# EAGLE schematic iMX233-OLinuXino-NANO_Rev_B (EAGLE 7.2.0)
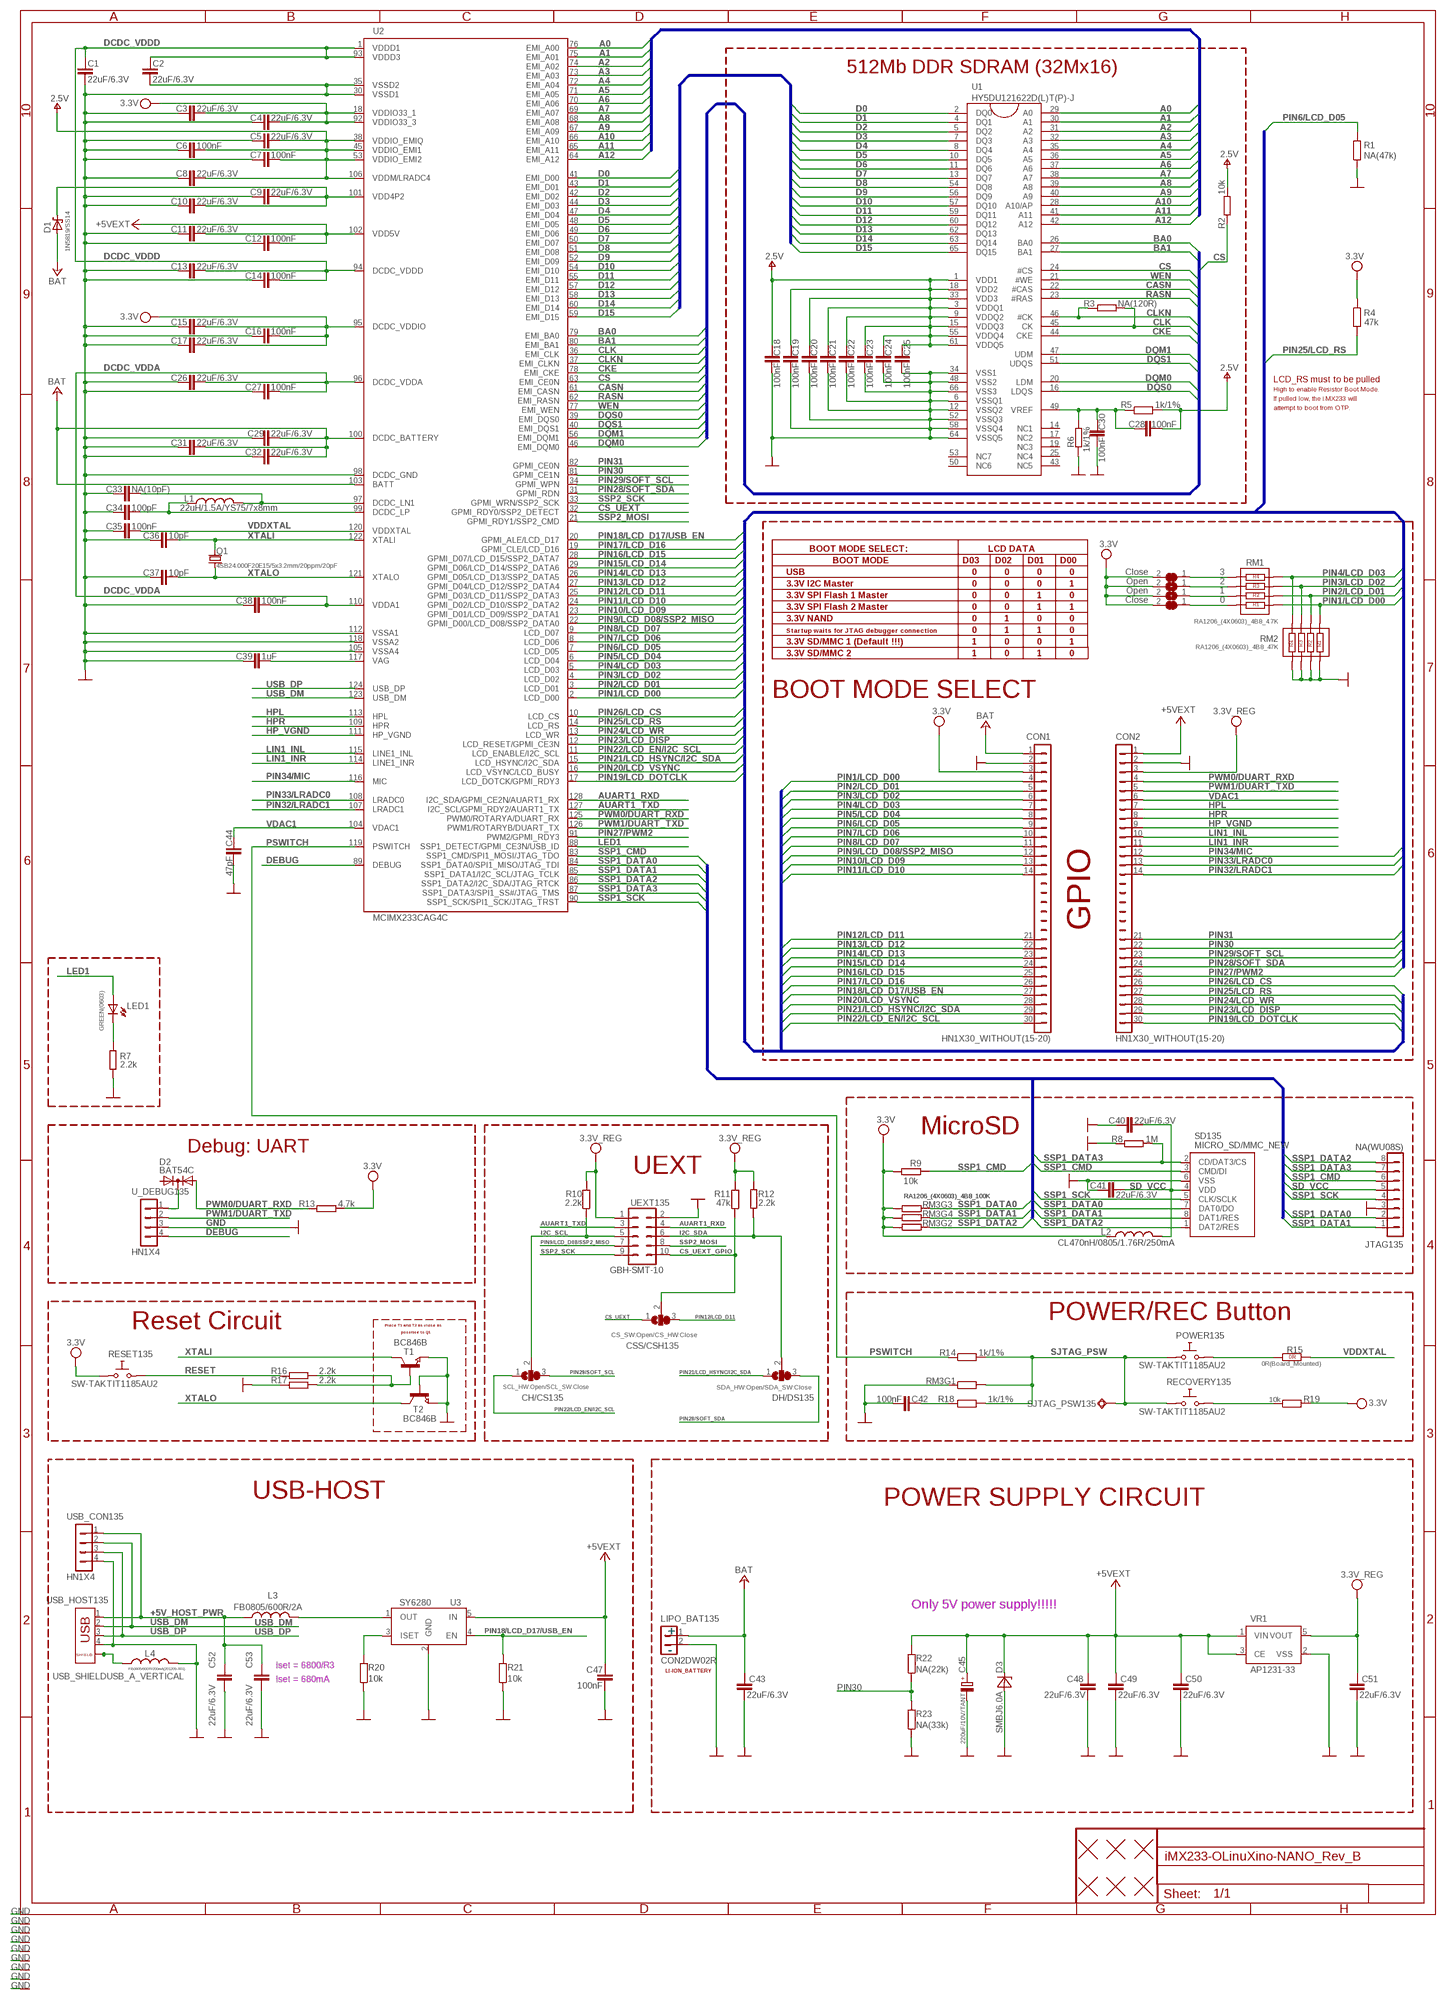
[diagram p0: schematic, sheet 1]

## Parts
0  Close  SJSJ_SMALLER  [SJ_1_SMALLER]
1  Open  SJSJ_SMALLER  [SJ_1_SMALLER]
2  Open  SJSJ_SMALLER  [SJ_1_SMALLER]
3  Close  SJSJ_SMALLER  [SJ_1_SMALLER]
C1  22uF/6.3V  C-EUC0603_DWS  [C0603_DWS]
C2  22uF/6.3V  C-EUC0603_DWS  [C0603_DWS]
C3  22uF/6.3V  C-EUC0603_DWS  [C0603_DWS]
C4  22uF/6.3V  C-EUC0603_DWS  [C0603_DWS]
C5  22uF/6.3V  C-EUC0603_DWS  [C0603_DWS]
C6  100nF  C-EUC0402_TI  [C0402_TI]
C7  100nF  C-EUC0402_TI  [C0402_TI]
C8  22uF/6.3V  C-EUC0603_DWS  [C0603_DWS]
C9  22uF/6.3V  C-EUC0603_DWS  [C0603_DWS]
C10  22uF/6.3V  C-EUC0603_DWS  [C0603_DWS]
C11  22uF/6.3V  C-EUC0603_DWS  [C0603_DWS]
C12  100nF  C-EUC0402_TI  [C0402_TI]
C13  22uF/6.3V  C-EUC0603_DWS  [C0603_DWS]
C14  100nF  C-EUC0402_TI  [C0402_TI]
C15  22uF/6.3V  C-EUC0603_DWS  [C0603_DWS]
C16  100nF  C-EUC0402_TI  [C0402_TI]
C17  22uF/6.3V  C-EUC0603_DWS  [C0603_DWS]
C18  100nF  C-EUC0402_TI  [C0402_TI]
C19  100nF  C-EUC0402_TI  [C0402_TI]
C20  100nF  C-EUC0402_TI  [C0402_TI]
C21  100nF  C-EUC0402_TI  [C0402_TI]
C22  100nF  C-EUC0402_TI  [C0402_TI]
C23  100nF  C-EUC0402_TI  [C0402_TI]
C24  100nF  C-EUC0402_TI  [C0402_TI]
C25  100nF  C-EUC0402_TI  [C0402_TI]
C26  22uF/6.3V  C-EUC0603_DWS  [C0603_DWS]
C27  100nF  C-EUC0402_TI  [C0402_TI]
C28  100nF  C-EUC0402_TI  [C0402_TI]
C29  22uF/6.3V  C-EUC0603_DWS  [C0603_DWS]
C30  100nF  C-EUC0402_TI  [C0402_TI]
C31  22uF/6.3V  C-EUC0603_DWS  [C0603_DWS]
C32  22uF/6.3V  C-EUC0603_DWS  [C0603_DWS]
C33  NA(10pF)  C-EUC0603_DWS  [C0603_DWS]
C34  100pF  C-EUC0603_DWS  [C0603_DWS]
C35  100nF  C-EUC0402_TI  [C0402_TI]
C36  10pF  C-EUC0603_DWS  [C0603_DWS]
C37  10pF  C-EUC0603_DWS  [C0603_DWS]
C38  100nF  C-EUC0402_TI  [C0402_TI]
C39  1uF  C-EUC0603_DWS  [C0603_DWS]
C40  22uF/6.3V  C-EUC0603_DWS  [C0603_DWS]
C41  22uF/6.3V  C-EUC0603_DWS  [C0603_DWS]
C42  100nF  C-EUC0402_TI  [C0402_TI]
C43  22uF/6.3V  C-EUC0603_DWS  [C0603_DWS]
C44  47pF  C-EUC0603_DWS  [C0603_DWS]
C45  220uF/10V/TANT  CPOL-EUCT7343  [CT7343]
C47  100nF  C-EUC0603_DWS  [C0603_DWS]
C48  22uF/6.3V  C-EUC0603_DWS  [C0603_DWS]
C49  22uF/6.3V  C-EUC0603_DWS  [C0603_DWS]
C50  22uF/6.3V  C-EUC0603_DWS  [C0603_DWS]
C51  22uF/6.3V  C-EUC0603_DWS  [C0603_DWS]
C52  22uF/6.3V  C-EUC0603_DWS  [C0603_DWS]
C53  22uF/6.3V  C-EUC0603_DWS  [C0603_DWS]
CH/CS135  SCL_HW:Open/SCL_SW:Close  SJ2W4  [SJ_2_SMALLER]
CON1  HN1X30_WITHOUT(15-20)  CON30_WITHOUT(15-20)  [HN1X30_WITHOUT(15-20)]
CON2  HN1X30_WITHOUT(15-20)  CON30_WITHOUT(15-20)  [HN1X30_WITHOUT(15-20)]
CSS/CSH135  CS_SW:Open/CS_HW:Close  SJ2W4  [SJ_2_SMALLER]
D1  1N5819/SS14  SCHOTKKY7.62SS2  [MLL-41]
D2  BAT54C  DIODE_AC-CA_  [SOT23C]
D3  SMBJ6.0A  SMBJ16A  [DO214AA]
DH/DS135  SDA_HW:Open/SDA_SW:Close  SJ2W4  [SJ_2_SMALLER]
JTAG135  NA(WU08S)  CON8WU08S  [WU08S]
L1  22uH/1.5A/YS75/7x8mm  L-USL7078  [L7078]
L2  CL470nH/0805/1.76R/250mA  L-USL0805_5MIL_DWS  [L0805_5MIL_DWS]
L3  FB0805/600R/2A  L-USL0805_5MIL_DWS  [L0805_5MIL_DWS]
L4  FB0805/600R/200mA(201209-601)  L-USL0805_5MIL_DWS  [L0805_5MIL_DWS]
LED1  GREEN(0603)  LED0603DWS  [LED-0603]
LIPO_BAT135  CON2DW02R  [DW02R]
POWER135  SW-TAKTIT1185AU2  [IT1185AU2]
Q1  4SB24.000F20E15/5x3.2mm/20ppm/20pF  HC49/S_E4SB25.000F20E15  [HCX-4S]
R1  NA(47k)  R-EU_R0603_5MIL_DWS  [R0603_5MIL_DWS]
R2  10k  R-EU_R0603_5MIL_DWS  [R0603_5MIL_DWS]
R3  NA(120R)  R-EU_R0603_5MIL_DWS  [R0603_5MIL_DWS]
R4  47k  R-EU_R0603_5MIL_DWS  [R0603_5MIL_DWS]
R5  1k/1%  R-EU_R0603_5MIL_DWS  [R0603_5MIL_DWS]
R6  1k/1%  R-EU_R0603_5MIL_DWS  [R0603_5MIL_DWS]
R7  2.2k  R-EU_R0603_5MIL_DWS  [R0603_5MIL_DWS]
R8  1M  R-EU_R0603_5MIL_DWS  [R0603_5MIL_DWS]
R9  10k  R-EU_R0603_5MIL_DWS  [R0603_5MIL_DWS]
R10  2.2k  R-EU_R0603_5MIL_DWS  [R0603_5MIL_DWS]
R11  47k  R-EU_R0603_5MIL_DWS  [R0603_5MIL_DWS]
R12  2.2k  R-EU_R0603_5MIL_DWS  [R0603_5MIL_DWS]
R13  4.7k  R-EU_R0603_5MIL_DWS  [R0603_5MIL_DWS]
R14  1k/1%  R-EU_R0603_5MIL_DWS  [R0603_5MIL_DWS]
R15  0R(Board_Mounted)  R_0R0R(NA)  [0603_0R]
R16  2.2k  R-EU_R0603_5MIL_DWS  [R0603_5MIL_DWS]
R17  2.2k  R-EU_R0603_5MIL_DWS  [R0603_5MIL_DWS]
R18  1k/1%  R-EU_R0603_5MIL_DWS  [R0603_5MIL_DWS]
R19  10k  R-EU_R0603_5MIL_DWS  [R0603_5MIL_DWS]
R20  10k  R-EU_R0603_5MIL_DWS  [R0603_5MIL_DWS]
R21  10k  R-EU_R0603_5MIL_DWS  [R0603_5MIL_DWS]
R22  NA(22k)  R-EU_R0603_5MIL_DWS  [R0603_5MIL_DWS]
R23  NA(33k)  R-EU_R0603_5MIL_DWS  [R0603_5MIL_DWS]
RECOVERY135  SW-TAKTIT1185AU2  [IT1185AU2]
RESET135  SW-TAKTIT1185AU2  [IT1185AU2]
RM1  RA1206_(4X0603)_4B8_4.7K  R_MATRIX_4  [R_MATRIX_4]
RM2  RA1206_(4X0603)_4B8_47K  R_MATRIX_4  [R_MATRIX_4]
RM3  RA1206_(4X0603)_4B8_100K  R_MATRIX_4E  [R_MATRIX_4]
SD135  MICRO_SD/MMC_NEW  [TFR/C-MEM-CON]
SJTAG_PSW135  TESTPAD40/70  [TESTPAD]
T1  BC846B  NPN-TRANSISTOR_SOT23  [SOT23]
T2  BC846B  NPN-TRANSISTOR_SOT23  [SOT23]
U1  HY5DU121622D(L)T(P)-J  [66TSOP-II]
U2  MCIMX233CAG4C  MCIMX233DAG4B_LD  [TQFP128LD]
U3  SY6280  [SOT23-5]
U$1  FIDUCIAL1X2  [FIDUCIAL-1X2]
U$2  FIDUCIAL1X2  [FIDUCIAL-1X2]
U$3  FIDUCIAL1X2  [FIDUCIAL-1X2]
U$7  FIDUCIAL1X2  [FIDUCIAL-1X2]
U$13  FIDUCIAL1X2  [FIDUCIAL-1X2]
U$14  FIDUCIAL1X2  [FIDUCIAL-1X2]
U_DEBUG135  HN1X4  CON4HN1X4  [HN1X4]
UEXT135  GBH-SMT-10  ML10MD  [ML10_S]
USB_CON135  HN1X4  CON4HN1X4  [HN1X4]
USB_HOST135  USB_SHIELDUSB_A_VERTICAL  [USB_A_VERTICAL_PTH]
VP_0  VPDEV0  [VPAC0]
VP_1  VPDEV1  [VPAC1]
VP_2  VPDEV1  [VPAC1]
VP_3  VPDEV1  [VPAC1]
VP_4  VPDEV1  [VPAC1]
VP_5  VPDEV1  [VPAC1]
VP_6  VPDEV1  [VPAC1]
VP_7  VPDEV1  [VPAC1]
VP_8  VPDEV1  [VPAC1]
VR1  AP1231-33  [SOT-23-5]

## Nets
+5V: C11.2 C12.2 C45.+ C47.1 C48.1 C49.1 C50.1 CON2.1 D3.C R22.2 U2.102(VDD5V) U3.5(IN) VR1.1(VIN) VR1.3(CE) ; supply symbol labelled +5VEXT
+5V_HOST_PWR: C52.1 C53.1 L3.1 USB_CON135.1 USB_HOST135.1
+24V: C29.2 C31.2 C32.2 C43.1 CON1.1 D1.A LIPO_BAT135.1 U2.100(DCDC_BATTERY) U2.103(BATT) ; supply symbol labelled BAT
A0: U1.29(A0) U2.76(EMI_A00)
A1: U1.30(A1) U2.75(EMI_A01)
A2: U1.31(A2) U2.74(EMI_A02)
A3: U1.32(A3) U2.73(EMI_A03)
A4: U1.35(A4) U2.72(EMI_A04)
A5: U1.36(A5) U2.71(EMI_A05)
A6: U1.37(A6) U2.70(EMI_A06)
A7: U1.38(A7) U2.69(EMI_A07)
A8: U1.39(A8) U2.68(EMI_A08)
A9: U1.40(A9) U2.67(EMI_A09)
A10: U1.28(A10/AP) U2.66(EMI_A10)
A11: U1.41(A11) U2.65(EMI_A11)
A12: U1.42(A12) U2.64(EMI_A12)
AUART1_RXD: U2.128(I2C_SDA/GPMI_CE2N/AUART1_RX) UEXT135.4
AUART1_TXD: U2.127(I2C_SCL/GPMI_RDY2/AUART1_TX) UEXT135.3
BA0: U1.26(BA0) U2.79(EMI_BA0)
BA1: U1.27(BA1) U2.80(EMI_BA1)
CASN: U1.22(#CAS) U2.61(EMI_CASN)
CKE: U1.44(CKE) U2.78(EMI_CKE)
CLK: R3.2 U1.45(CK) U2.36(EMI_CLK)
CLKN: R3.1 U1.46(#CK) U2.37(EMI_CLKN)
CS: R2.1 U1.24(#CS) U2.63(EMI_CE0N)
CS_UEXT: CSS/CSH135.1 U2.32(GPMI_RDY0/SSP2_DETECT)
CS_UEXT_GPIO: CSS/CSH135.2 R11.1 UEXT135.10
D0: U1.2(DQ0) U2.41(EMI_D00)
D1: U1.4(DQ1) U2.43(EMI_D01)
D2: U1.5(DQ2) U2.42(EMI_D02)
D3: U1.7(DQ3) U2.44(EMI_D03)
D4: U1.8(DQ4) U2.47(EMI_D04)
D5: U1.10(DQ5) U2.48(EMI_D05)
D6: U1.11(DQ6) U2.49(EMI_D06)
D7: U1.13(DQ7) U2.50(EMI_D07)
D8: U1.54(DQ8) U2.51(EMI_D08)
D9: U1.56(DQ9) U2.52(EMI_D09)
D10: U1.57(DQ10) U2.54(EMI_D10)
D11: U1.59(DQ11) U2.55(EMI_D11)
D12: U1.60(DQ12) U2.57(EMI_D12)
D13: U1.62(DQ13) U2.58(EMI_D13)
D14: U1.63(DQ14) U2.60(EMI_D14)
D15: U1.65(DQ15) U2.59(EMI_D15)
DCDC_VDDA: C26.2 C27.2 C38.2 U2.96(DCDC_VDDA) U2.110(VDDA1)
DCDC_VDDD: C1.2 C2.2 C13.2 C14.2 U2.1(VDDD1) U2.93(VDDD3) U2.94(DCDC_VDDD)
DEBUG: U2.89(DEBUG) U_DEBUG135.4
DQM0: U1.20(LDM) U2.46(EMI_DQM0)
DQM1: U1.47(UDM) U2.56(EMI_DQM1)
DQS0: U1.16(LDQS) U2.39(EMI_DQS0)
DQS1: U1.51(UDQS) U2.40(EMI_DQS1)
GND [pwr-II]: C1.1 C2.1 C3.1 C4.1 C5.1 C6.1 C7.1 C8.1 C9.1 C10.1 C11.1 C12.1 C13.1 C14.1 C15.1 C16.1 C17.1 C18.1 C19.1 C20.1 C21.1 C22.1 C23.1 C24.1 C25.1 C26.1 C27.1 C29.1 C30.1 C31.1 C32.1 C33.1 C34.1 C35.1 C36.1 C37.1 C38.1 C39.1 C40.1 C41.1 C42.2 C43.2 C44.2 C45.- C47.2 C48.2 C49.2 C50.2 C51.2 C52.2 C53.2 CON1.2 CON2.2 D3.A JTAG135.3 L4.1 LIPO_BAT135.2 R1.1 R6.1 R7.1 R8.2 R17.2 R20.1 R21.1 R23.1 RM2.1.2 RM2.2.2 RM2.3.2 RM2.4.2 RM3.1.1 SD135.6(VSS) T1.2(E) T2.1(B) T2.2(E) U1.6(VSSQ1) U1.12(VSSQ2) U1.34(VSS1) U1.48(VSS2) U1.52(VSSQ3) U1.58(VSSQ4) U1.64(VSSQ5) U1.66(VSS3) U2.30(VSSD1) U2.35(VSSD2) U2.98(DCDC_GND) U2.105(VSSA4) U2.112(VSSA1) U2.118(VSSA2) U3.2(GND) U_DEBUG135.3 UEXT135.2 USB_CON135.4 USB_HOST135.4 VP_0.VP VP_1.VP VP_2.VP VP_3.VP VP_4.VP VP_5.VP VP_6.VP VP_7.VP VP_8.VP VR1.2(VSS)
HP_VGND: CON2.9 U2.111(HP_VGND)
HPL: CON2.7 U2.113(HPL)
HPR: CON2.8 U2.109(HPR)
I2C_SCL: CH/CS135.2 R10.1 UEXT135.5
I2C_SDA: DH/DS135.2 R12.1 UEXT135.6
LED1: LED1.A U2.88(SSP1_DETECT/GPMI_CE3N/USB_ID)
LIN1_INL: CON2.10 U2.115(LINE1_INL)
LIN1_INR: CON2.11 U2.114(LINE1_INR)
N$1: POWER135.1 R15.1(1.1)
N$3: L3.2 U3.1(OUT)
N$6: R20.2 U3.3(ISET)
N$7: C28.2 C30.2 R5.1 R6.2 U1.49(VREF)
N$9: R19.1 RECOVERY135.1
N$11: D2.3(K) U_DEBUG135.1
N$18: C33.2 L1.2 U2.97(DCDC_LN1)
N$19: C34.2 L1.1 U2.99(DCDC_LP)
N$25: C39.2 U2.117(VAG)
N$38: C42.1 R18.1
N$42: LED1.C R7.2
N$43: R16.1 R17.1 T1.1(B)
N$101: 3.1 RM1.4.1
N$103: 2.1 RM1.3.1
N$104: 1.1 RM1.2.1
N$105: 0.1 RM1.1.1
N$266: L4.2 USB_HOST135.P$3 USB_HOST135.P$4
PIN1/LCD_D00: CON1.4 RM1.1.2 RM2.1.1 U2.2(LCD_D00)
PIN2/LCD_D01: CON1.5 RM1.2.2 RM2.2.1 U2.3(LCD_D01)
PIN3/LCD_D02: CON1.6 RM1.3.2 RM2.3.1 U2.4(LCD_D02)
PIN4/LCD_D03: CON1.7 RM1.4.2 RM2.4.1 U2.5(LCD_D03)
PIN5/LCD_D04: CON1.8 U2.6(LCD_D04)
PIN6/LCD_D05: CON1.9 R1.2 U2.7(LCD_D05)
PIN7/LCD_D06: CON1.10 U2.8(LCD_D06)
PIN8/LCD_D07: CON1.11 U2.9(LCD_D07)
PIN9/LCD_D08/SSP2_MISO: CON1.12 U2.22(GPMI_D00/LCD_D08/SSP2_DATA0) UEXT135.7
PIN10/LCD_D09: CON1.13 U2.23(GPMI_D01/LCD_D09/SSP2_DATA1)
PIN11/LCD_D10: CON1.14 U2.24(GPMI_D02/LCD_D10/SSP2_DATA2)
PIN12/LCD_D11: CON1.21 CSS/CSH135.3 U2.25(GPMI_D03/LCD_D11/SSP2_DATA3)
PIN13/LCD_D12: CON1.22 U2.27(GPMI_D04/LCD_D12/SSP2_DATA4)
PIN14/LCD_D13: CON1.23 U2.26(GPMI_D05/LCD_D13/SSP2_DATA5)
PIN15/LCD_D14: CON1.24 U2.29(GPMI_D06/LCD_D14/SSP2_DATA6)
PIN16/LCD_D15: CON1.25 U2.28(GPMI_D07/LCD_D15/SSP2_DATA7)
PIN17/LCD_D16: CON1.26 U2.19(GPMI_CLE/LCD_D16)
PIN18/LCD_D17/USB_EN: CON1.27 R21.2 U2.20(GPMI_ALE/LCD_D17) U3.4(EN)
PIN19/LCD_DOTCLK: CON2.30 U2.17(LCD_DOTCK/GPMI_RDY3)
PIN20/LCD_VSYNC: CON1.28 U2.16(LCD_VSYNC/LCD_BUSY)
PIN21/LCD_HSYNC/I2C_SDA: CON1.29 DH/DS135.1 U2.15(LCD_HSYNC/I2C_SDA)
PIN22/LCD_EN/I2C_SCL: CH/CS135.1 CON1.30 U2.11(LCD_ENABLE/I2C_SCL)
PIN23/LCD_DISP: CON2.29 U2.12(LCD_RESET/GPMI_CE3N)
PIN24/LCD_WR: CON2.28 U2.13(LCD_WR)
PIN25/LCD_RS: CON2.27 R4.2 U2.14(LCD_RS)
PIN26/LCD_CS: CON2.26 U2.10(LCD_CS)
PIN27/PWM2: CON2.25 U2.91(PWM2/GPMI_RDY3)
PIN28/SOFT_SDA: CON2.24 DH/DS135.3 U2.31(GPMI_RDN)
PIN29/SOFT_SCL: CH/CS135.3 CON2.23 U2.34(GPMI_WPN)
PIN30: CON2.22 R22.1 R23.2 U2.81(GPMI_CE1N)
PIN31: CON2.21 U2.82(GPMI_CE0N)
PIN32/LRADC1: CON2.14 U2.107(LRADC1)
PIN33/LRADC0: CON2.13 U2.108(LRADC0)
PIN34/MIC: CON2.12 U2.116(MIC)
PSWITCH: R14.1 U2.119(PSWITCH)
PWM0/DUART_RXD: CON2.4 D2.2(A2) R13.2 U2.125(PWM0/ROTARYA/DUART_RX)
PWM1/DUART_TXD: CON2.5 U2.126(PWM1/ROTARYB/DUART_TX) U_DEBUG135.2
RASN: U1.23(#RAS) U2.62(EMI_RASN)
RESET: R16.2 RESET135.1
SD_VCC: C40.2 C41.2 JTAG135.5 L2.2 SD135.4(VDD)
SJTAG_PSW: POWER135.2 R14.2 R18.2 RECOVERY135.2 RM3.1.2 SJTAG_PSW135.P$1(PP)
SSP1_CMD: JTAG135.6 R9.1 SD135.3(CMD/DI) U2.83(SSP1_CMD/SPI1_MOSI/JTAG_TDO)
SSP1_DATA0: JTAG135.2 RM3.3.2 SD135.7(DAT0/DO) U2.84(SSP1_DATA0/SPI1_MISO/JTAG_TDI)
SSP1_DATA1: JTAG135.1 RM3.4.2 SD135.8(DAT1/RES) U2.85(SSP1_DATA1/I2C_SCL/JTAG_TCLK)
SSP1_DATA2: JTAG135.8 RM3.2.2 SD135.1(DAT2/RES) U2.86(SSP1_DATA2/I2C_SDA/JTAG_RTCK)
SSP1_DATA3: JTAG135.7 R8.1 SD135.2(CD/DAT3/CS) U2.87(SSP1_DATA3/SPI1_SS#/JTAG_TMS)
SSP1_SCK: JTAG135.4 SD135.5(CLK/SCLK) U2.90(SSP1_SCK/SPI1_SCK/JTAG_TRST)
SSP2_MOSI: U2.21(GPMI_RDY1/SSP2_CMD) UEXT135.8
SSP2_SCK: U2.33(GPMI_WRN/SSP2_SCK) UEXT135.9
USB_DM: U2.123(USB_DM) USB_CON135.2 USB_HOST135.2
USB_DP: U2.124(USB_DP) USB_CON135.3 USB_HOST135.3
V+: C5.2 C6.2 C7.2 C8.2 C18.2 C19.2 C20.2 C21.2 C22.2 C23.2 C24.2 C25.2 C28.1 R2.2 R5.2 U1.1(VDD1) U1.3(VDDQ1) U1.9(VDDQ2) U1.15(VDDQ3) U1.18(VDD2) U1.33(VDD3) U1.55(VDDQ4) U1.61(VDDQ5) U2.38(VDDIO_EMIQ) U2.45(VDDIO_EMI1) U2.53(VDDIO_EMI2) U2.106(VDDM/LRADC4) ; supply symbol labelled 2.5V
VCC [pwr-II]: 0.2 1.2 2.2 3.2 C3.2 C4.2 C15.2 C16.2 C17.2 CON1.3 L2.1 R4.1 R9.2 R13.1 R19.2 RESET135.2 RM3.2.1 RM3.3.1 RM3.4.1 U2.18(VDDIO33_1) U2.92(VDDIO33_3) U2.95(DCDC_VDDIO) ; supply symbol labelled 3.3V
VDAC1: C44.1 CON2.6 U2.104(VDAC1)
VDD4P2: C9.2 C10.2 D1.K(C) U2.101(VDD4P2)
VDDXTAL: C35.2 R15.2(1.2) U2.120(VDDXTAL)
VPP: C51.1 CON2.3 R10.2 R11.2 R12.2 UEXT135.1 VR1.5(VOUT) ; supply symbol labelled 3.3V_REG
WEN: U1.21(#WE) U2.77(EMI_WEN)
XTALI: C36.2 Q1.2 T1.3(C) U2.122(XTALI)
XTALO: C37.2 Q1.1 T2.3(C) U2.121(XTALO)
Unconnected: D2.1(A1) U1.14(NC1) U1.17(NC2) U1.19(NC3) U1.25(NC4) U1.43(NC5) U1.50(NC6) U1.53(NC7)

## Buses
A[0..12]
D[0..15]
SSP1_CMD/SPI1_MOSI,SSP1_DATA0/SPI1_MISO,SSP1_SCK/SPI1_SCK,SSP1_DATA3/SPI1_SS#,SSP1_DATA1/I2C_SCL,SSP1_DATA2/I2C_SDA
PIN18/LCD_D17,PIN17/LCD_D16,PIN16/LCD_D15,PIN15/LCD_D14,PIN14/LCD_D13,PIN13/LCD_D12,PIN12/LCD_D11,PIN11/LCD_D10,PIN10/LCD_D09,PIN9/LCD_D08/SSP2_MISO,PIN8/LCD_D07,PIN7/LCD_D06,PIN6/LCD_D05,PIN5/LCD_D04,PIN4/LCD_D03,PIN3/LCD_D02,PIN2/LCD_D01,PIN1/LCD_D00,PIN19/LCD_DOTCLK,PIN20/LCD_VSYNC,PIN21/LCD_HSYNC/I2C_SDA,PIN2/LCD_EN/I2C_SCL,PIN23/LCD_DISP,PIN26/LCD_CS,PIN25/LCD_RS,PIN24/LCD_WR
BA[0..1],CLK,CLKN,CKE,CS,CASN,RASN,WEN,DQM[0..1],DQS[0..1]

## Notes on the sheet
- 512Mb DDR SDRAM (32Mx16)
- LCD_RS must to be pulled
- High to enable Resistor Boot Mode.
- If pulled low, the i.MX233 will
- attempt to boot from OTP.
- BOOT MODE SELECT: | LCD DATA
- BOOT MODE | D03 | D02 | D01 | D00
- USB | 0 | 0 | 0 | 0
- 3.3V I2C Master | 0 | 0 | 0 | 1
- 3.3V SPI Flash 1 Master | 0 | 0 | 1 | 0
- 3.3V SPI Flash 2 Master | 0 | 0 | 1 | 1
- 3.3V NAND | 0 | 1 | 0 | 0
- Startup waits for JTAG debugger connection | 0 | 1 | 1 | 0
- 3.3V SD/MMC 1 (Default !!!) | 1 | 0 | 0 | 1
- 3.3V SD/MMC 2 | 1 | 0 | 1 | 0
- BOOT MODE SELECT
- GPIO
- MicroSD
- Debug: UART
- UEXT
- POWER/REC Button
- Place T1 and T2 as close as
- Reset Circuit
- possible to Q1
- USB-HOST | POWER SUPPLY CIRCUIT
- Only 5V power supply!!!!!
- +
- -
- Iset = 6800/R3
- LI-ION_BATTERY
- Iset = 680mA

## Library data of the parts
0 1-3 = jumper:SJ: SMD solder JUMPER
C1-C44 C47-C53 = rcl:C-EU: CAPACITOR, European symbol
C45 = rcl:CPOL-EU: POLARIZED CAPACITOR, European symbol
CH/CS135 CSS/CSH135 DH/DS135 = jumper:SJ2W: SMD solder JUMPER
CON1 CON2 = Penko:CON30_WITHOUT(15-20)
D1 = gogo:SCHOTKKY7.62SS
D2 = semicon-smd-ipc:DIODE_AC-CA_: DUAL DIODE
D3 = OLIMEX_DISCRET:SMBJ16A
JTAG135 = Penko:CON8
L1-L4 = rcl:L-US: INDUCTOR, American symbol
LED1 = DOUBLE-SIDE:LED
LIPO_BAT135 = Penko:CON2
POWER135 RECOVERY135 RESET135 = gogo:SW-TAKT
Q1 = crystal:HC49/S: CRYSTAL
R1-R14 R16-R23 = rcl:R-EU_: RESISTOR, European symbol
R15 = OLIMEX_DISCRET:R_0R
RM1 RM2 = OLIMEX_DISCRET:R_MATRIX_4
RM3 = OLIMEX_DISCRET:R_MATRIX_4E
SD135 = OLIMEX_CONNECTORS:MICRO_SD/MMC
SJTAG_PSW135 = gogo:TESTPAD: drill 40mils, diameter 70mils
T1 T2 = semicon-smd-ipc:NPN-TRANSISTOR_: NPN TRANSISTOR
U1 = OLIMEX_IC:HY5DU121622D(L)T(P)
U2 = OLIMEX_IC:MCIMX233DAG4B: i.MX23
U3 = OLIMEX_IC:SY6280
U$1-U$3 U$7 U$13 U$14 = SparkFunEagle-6-6-07:FIDUCIAL: Fiducial Alignment Points Various fiducial points for machine vision alignment.
U_DEBUG135 USB_CON135 = Penko:CON4
UEXT135 = con-harting-ml:ML10: HARTING
USB_HOST135 = OLIMEX_CONNECTORS:USB_SHIELD
VP_0 = vpad:VPDEV0: VIAPAD
VP_1-VP_8 = vpad:VPDEV1: VIAPAD
VR1 = OLIMEX_DISCRET:AP1231